# EAGLE design D1-Mini_Adapter_V4 (EAGLE 9.6.2)
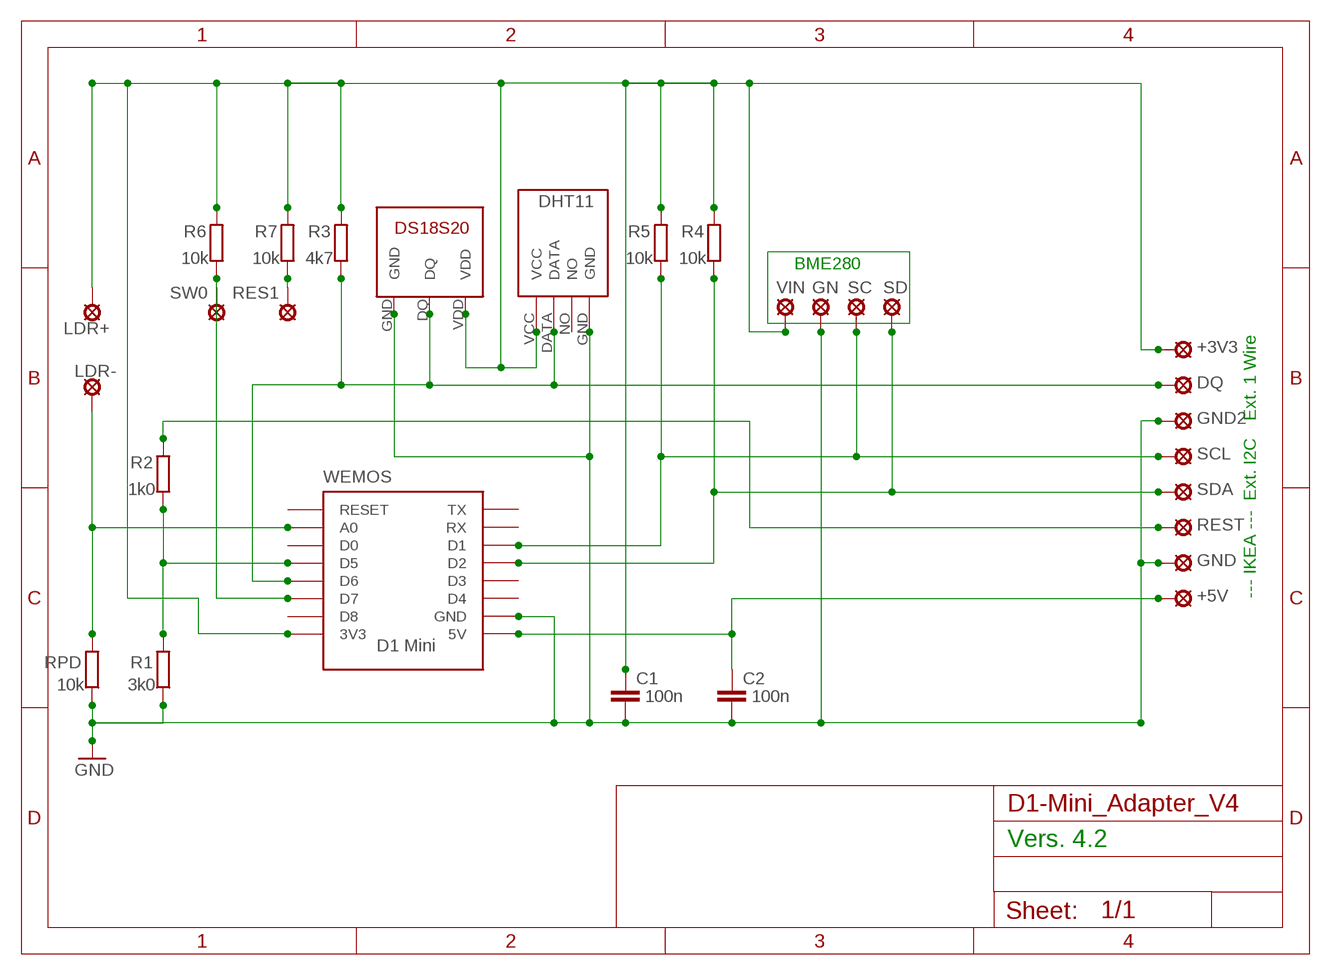
[diagram p0: schematic, sheet 1]

## Parts
+3V3  SE13  [SE13]
+5V  SE13  [SE13]
C1  100n  C-EU025_050-045X075  [C025_050-045X075]
C2  100n  C-EU025_050-045X075  [C025_050-045X075]
DQ  SE13  [SE13]
DS1820  DS18S20  [DS18S20-PACKAGE]
GN  SE13  [SE13]
GND  SE13  [SE13]
GND2  SE13  [SE13]
LDR+  SE13  [SE13]
LDR-  SE13  [SE13]
R1  3k0  R-EU_0207/10  [0207/10]
R2  1k0  R-EU_0207/10  [0207/10]
R3  4k7  R-EU_0207/10  [0207/10]
R4  10k  R-EU_0207/10  [0207/10]
R5  10k  R-EU_0207/10  [0207/10]
R6  10k  R-EU_0207/10  [0207/10]
R7  10k  R-EU_0207/10  [0207/10]
RES1  SE13  [SE13]
REST  SE13  [SE13]
RPD  10k  R-EU_0207/10  [0207/10]
SC  SE13  [SE13]
SCL  SE13  [SE13]
SD  SE13  [SE13]
SDA  SE13  [SE13]
SW0  SE13  [SE13]
U$1  DHT11-PION.  [DHT11-PION.]
VIN  LSP13  [LSP13]
WEMOS  D1 Mini  WEMOS-D1-MINI  [WEMOS-D1-MINI]

## Nets
3V3: +3V3.MP C1.1 DS1820.VDD LDR+.MP R3.2 R4.2 R5.2 R6.2 R7.2 U$1.VCC VIN.MP WEMOS.3V3
+5V: +5V.MP C2.1 WEMOS.5V
D5: R1.2 R2.1 WEMOS.D5
DQ: DQ.MP DS1820.DQ R3.1 U$1.DATA WEMOS.D6
GND: C1.2 C2.2 DS1820.GND GN.MP GND2.MP GND.MP R1.1 RPD.1 U$1.GND WEMOS.GND
LDR: LDR-.MP RPD.2 WEMOS.A0
RES1: R7.1 RES1.MP
REST: R2.2 REST.MP
SCL: R5.1 SC.MP SCL.MP WEMOS.D1
SDA: R4.1 SD.MP SDA.MP WEMOS.D2
SW0: R6.1 SW0.MP WEMOS.D7
Unconnected: U$1.NO WEMOS.D0 WEMOS.D3 WEMOS.D4 WEMOS.D8 WEMOS.RESET WEMOS.RX WEMOS.TX

## Notes on the sheet
- BME280
- Ext. 1 Wire
- Ext. I2C
- --- IKEA ---
- Vers. 4.2

## Library data of the parts
+3V3 +5V DQ GN GND GND2 LDR+ LDR- RES1 REST SC SCL SD SDA SW0 = solpad:SE13: SOLDER PAD E1542, drill 1,3mm, distributor Buerklin, 07F815
C1 C2 = Michaels_Lib:C-EU: CAPACITOR, European symbol
DS1820 = Michaels_Lib:DS18S20
R1-R7 RPD = resistor:R-EU_: RESISTOR, European symbol
U$1 = DHT11:DHT11-PION.: DHT11 Czujnik temperatury i wilgotności (widok pionowy)
VIN = solpad:LSP13: SOLDER PAD drill 1.3 mm, distributor Buerklin, 12H562
WEMOS = esp8266modules:WEMOS-D1-MINI: WeMos.cc D1 mini ESP8266 module

## Board
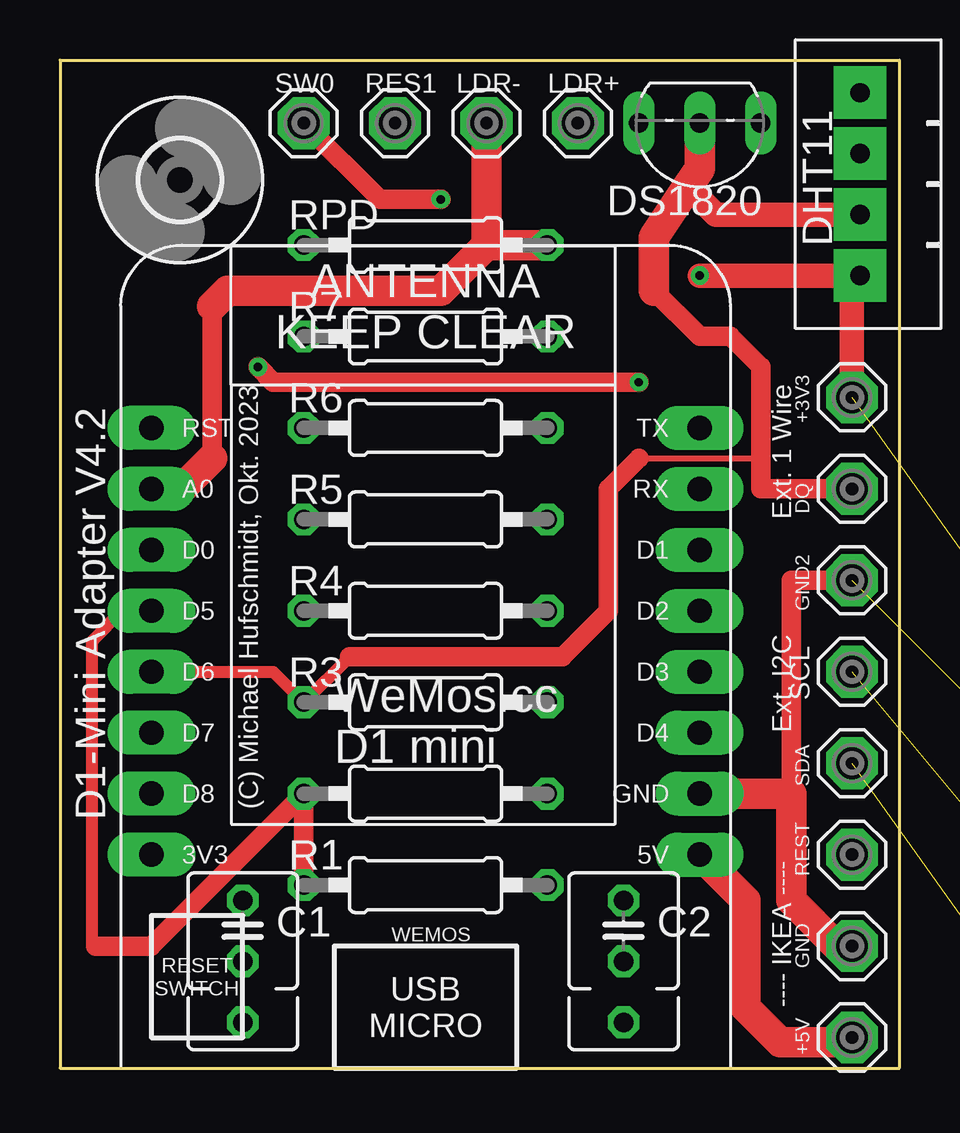
[diagram p1: board, top side]
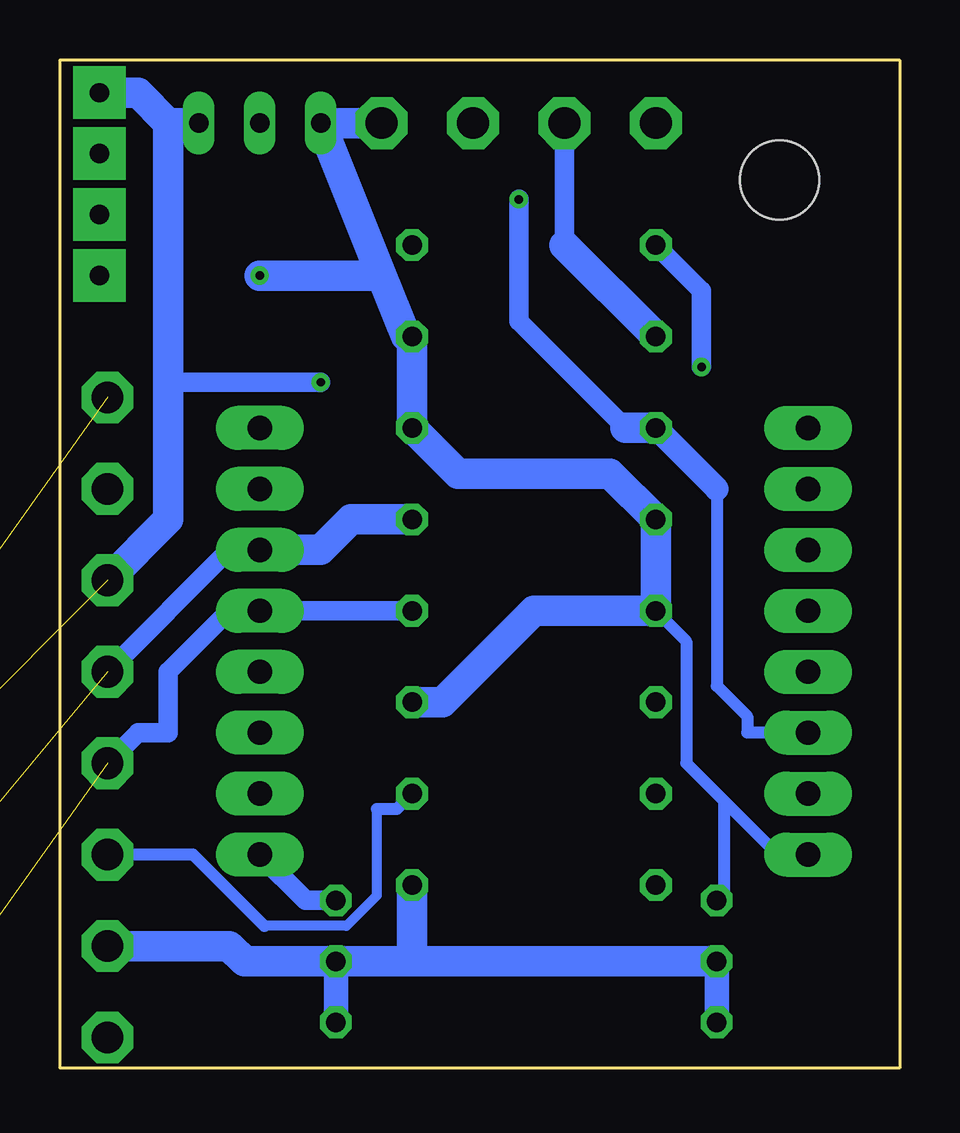
[diagram p2: board, bottom side, seen from below]

Size 35 x 42 mm. Coordinates in mm from the lower left corner, seen from the top.
Outline: 0,0 35,0 35,42 0,42 0,0
Copper layers (1*16): Top 0.035mm / dielectric 1.5mm / Bottom 0.035mm
Design rules "default *": minimum track width 10mil, minimum drill 0.35mm, track to track 6mil, track to pad 6mil, pad to pad 6mil, via to via 6mil, smd to smd 6mil, copper to edge 40mil, drill to drill 6mil, minimum pad ring 10mil, minimum via ring 8mil, stop-mask expansion 4mil, vias tented up to drill 0mil, thermal gap 10mil

### Footprints (pad centres in the part's own frame; a part is rotated, then mirrored left to right if it is on the bottom)
SE13 = drill 1.321 pad 2.159 octagon: MP 0,0
C025_050-045X075 = drill 0.813 octagon: 1 -1.27,0; 2 1.27,0; 3 3.81,0
DS18S20-PACKAGE = drill 0.813 long: DQ 0,0; GND -2.54,0; VDD 2.54,0
0207/10 = drill 0.813 octagon: 1 -5.08,0; 2 5.08,0
DHT11-PION. = drill 0.8 pad 2.184 square: DATA -1.27,0.305; GND 3.81,0.305; NO 1.27,0.305; VCC -3.81,0.305
3,3 = hole 3.3: 0,0
LSP13 = drill 1.321 pad 2.159 octagon: MP 0,0
WEMOS-D1-MINI = drill 1.016 pad 1.829 long: 3V3 -10.16,-10.16; 5V 12.7,-10.16; A0 -10.16,5.08; D0 -10.16,2.54; D1 12.7,2.54; D2 12.7,0; D3 12.7,-2.54; D4 12.7,-5.08; D5 -10.16,0; D6 -10.16,-2.54; D7 -10.16,-5.08; D8 -10.16,-7.62; GND 12.7,-7.62; RESET -10.16,7.62; RX 12.7,5.08; TX 12.7,7.62

### Placement (x,y rotation side)
+3V3  33.02,27.94 0 top
+5V  33.02,1.27 0 top
C1  7.62,5.71 270 top
C2  23.5,5.71 270 top
DQ  33.02,24.13 0 top
DS1820  26.67,39.37 180 top
GN  39.37,13.97 0 top  (outside the outline)
GND  33.02,5.08 0 top
GND2  33.02,20.32 0 top
LDR+  21.59,39.37 0 top
LDR-  17.78,39.37 0 top
R1  15.24,7.62 180 top
R2  15.24,11.43 0 top
R3  15.24,15.24 0 top
R4  15.24,19.05 180 top
R5  15.24,22.86 180 top
R6  15.24,26.67 0 top
R7  15.24,30.48 0 top
RES1  13.97,39.37 0 top
REST  33.02,8.89 0 top
RPD  15.24,34.29 0 top
SC  39.37,8.89 0 top  (outside the outline)
SCL  33.02,16.51 0 top
SD  39.37,3.81 0 top  (outside the outline)
SDA  33.02,12.7 0 top
SW0  10.16,39.37 180 top
U$1  33.66,36.83 90 top
U$2  [3,3]  5,37 0 top
VIN  39.37,19.05 0 top  (outside the outline)
WEMOS  13.97,19.05 0 top

### Tracks (layer width: path | path; a pad name or v marks a point on that pad's centre or on a via)
3V3  (via drill 0.35)  (1 unrouted)
  Top 1.016: v26.67,33.02 U$1.VCC 33.02,32.69 +3V3.MP
  Bottom 0.508: 7.3,11.11 5.08,8.89 WEMOS.3V3 | 7.3,11.11 8.89,12.7 8.89,17.78 R4.2 | C1.1 7.3,7.3 7.3,11.11
  Bottom 1.27: R3.2 19.05,15.24 15.24,19.05 R4.2 R5.2 12.06,24.77 18.41,24.77 R6.2 R7.2 20.57,30.48 21.59,33.02 | 21.59,33.02 DS1820.VDD LDR+.MP | v26.67,33.02 21.59,33.02
+5V
  Top 1.27: +5V.MP 33.02,1.08 30.04,1.08 28.57,2.54 28.57,6.99 WEMOS.5V
  Bottom 0.813: C2.1 24.77,6.99 WEMOS.5V
D5
  Top 0.508: 1.49,5.08 1.33,5.23 1.33,17.78 2.6,19.05 WEMOS.D5
  Top 0.813: 1.49,5.08 3.81,5.08 R2.1 R1.2
DQ
  Top 0.254: 24.13,25.4 29.21,25.4
  Top 0.5: WEMOS.D6 8.89,16.51
  Top 0.508: 8.89,16.51 R3.1 12.06,17.14
  Top 0.813: 12.06,17.14 20.95,17.14 22.86,19.05 22.86,24.13 24.13,25.4 | DQ.MP 29.21,24.13 29.21,25.4 29.21,29.21 27.94,30.48 26.67,30.48 24.77,32.38
  Top 1.016: U$1.DATA 27.35,35.56 26.18,36.73
  Top 1.27: 24.77,32.38 24.77,34.61 26.18,36.73 26.67,37.47 DS1820.DQ
GND  (via drill 0.35)  (1 unrouted)
  Top 0.813: 30.48,11.43 30.48,20.32 GND2.MP | v8.26,29.21 8.89,28.57 v24.13,28.57
  Top 1.27: GND.MP 32.38,5.08 30.48,6.99 30.48,11.43 WEMOS.GND
  Bottom 0.813: v24.13,28.57 30.48,28.57 | v8.26,29.21 8.26,32.38 RPD.1
  Bottom 1.27: GND.MP 27.94,5.08 27.3,4.45 C2.2 20.32,4.45 | GND2.MP 30.48,22.86 30.48,28.57 30.48,39.37 | 30.48,39.37 31.75,40.64 U$1.GND | R1.1 20.32,4.45 | C1.2 20.32,4.45 | DS1820.GND 30.48,39.37
LDR
  Top 0.813: 6.35,31.75 6.35,25.4
  Top 1.27: 6.35,31.75 6.99,32.38 15.88,32.38 17.78,34.29 | RPD.2 17.78,34.29 | 6.35,25.4 5.08,24.13 WEMOS.A0 | LDR-.MP 17.78,34.29
RES1
  Bottom 0.813: RES1.MP 13.97,34.29
  Bottom 1.27: 13.97,34.29 R7.1
REST
  Bottom 0.406: 26.48,5.92 23.05,5.92 21.79,7.18 21.79,10.79
  Bottom 0.508: 21.79,10.79 20.95,10.79 R2.2 | REST.MP 29.45,8.89 26.48,5.92
SCL  (1 unrouted)
  Bottom 0.813: SCL.MP 27.94,21.59 WEMOS.D1
  Bottom 1.27: R5.1 22.86,22.86 24.13,21.59 WEMOS.D1
SDA  (1 unrouted)
  Bottom 0.813: SDA.MP 31.75,13.97 30.48,13.97 30.48,16.51 27.94,19.05 WEMOS.D2 R4.1
SW0  (via drill 0.35)
  Top 0.813: v15.88,36.2 13.34,36.2 SW0.MP
  Bottom 0.5: 7.62,24.13 7.62,15.92
  Bottom 0.508: 7.62,15.92 6.35,14.65 6.35,13.97 WEMOS.D7
  Bottom 0.813: 11.43,26.67 15.88,31.11 v15.88,36.2
  Bottom 1: R6.1 7.62,24.13
  Bottom 1.27: 11.43,26.67 R6.1

### Text on the board
tPlace: Ext. 1 Wire | Ext. I2C | (C) Michael Hufschmidt, Okt. 2023 | D1-Mini Adapter V4.2 | ---- IKEA ----